# EasyEDA Pro project 单向户外电源_明月班.epro, board PCB11
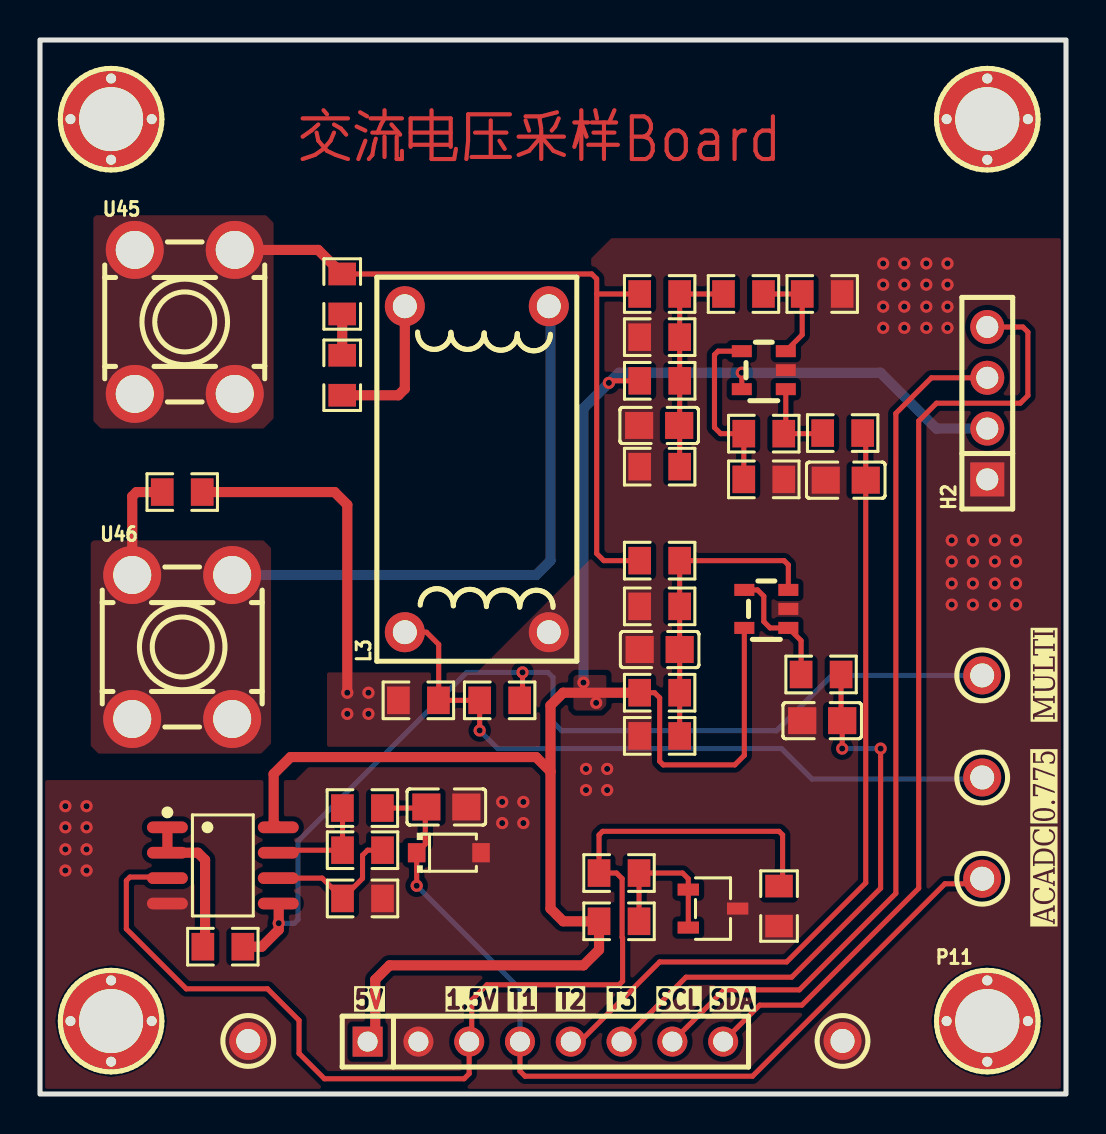
[diagram p18: board, top side]
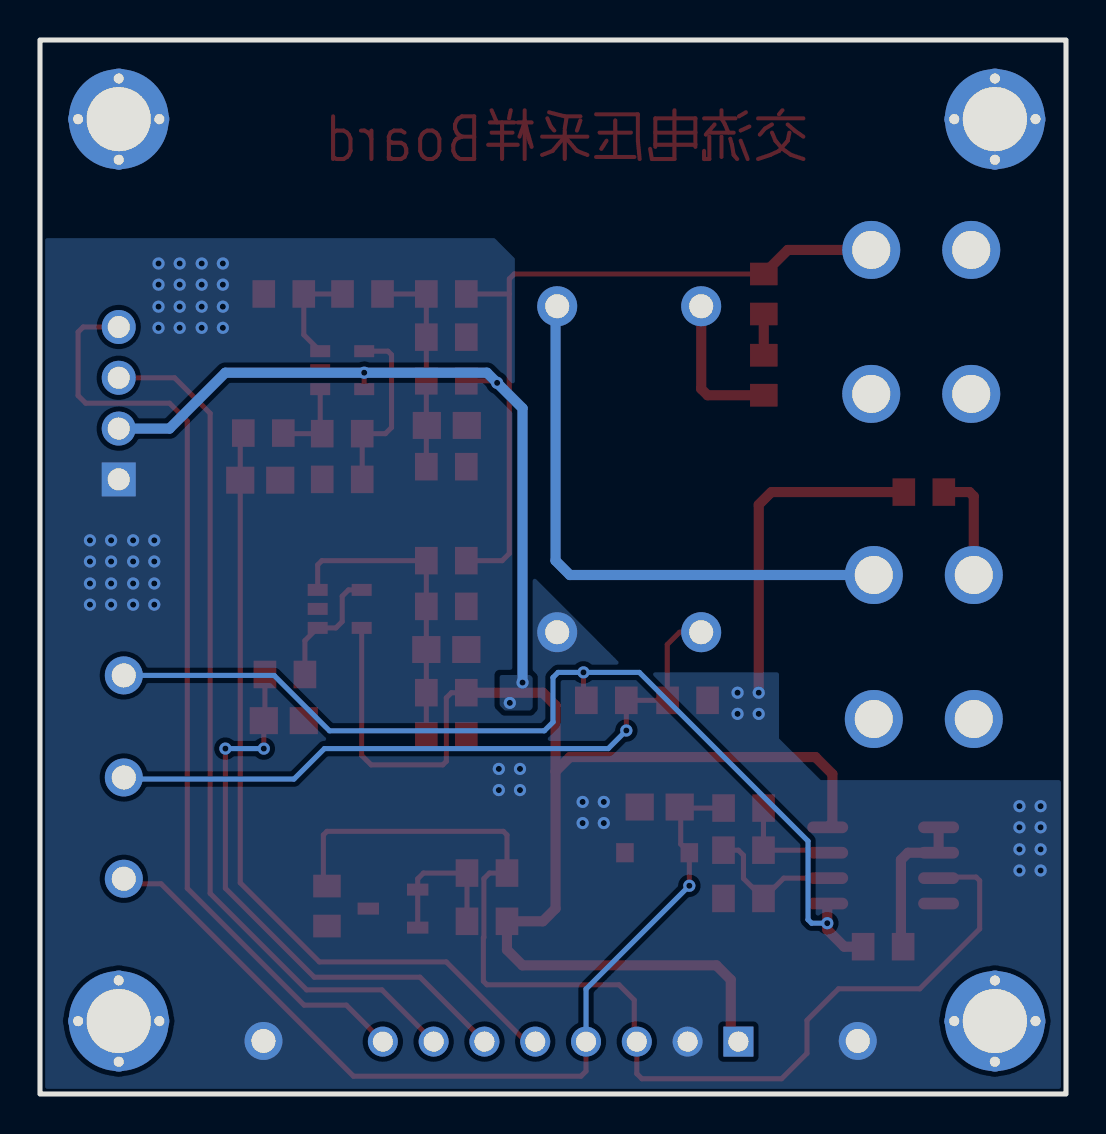
[diagram p19: board, bottom side, seen from below]

Outline 51.31 x 52.71 mm; copper layers: Top Layer, Bottom Layer. Coordinates in mm from the lower left corner of the outline.
Outline path: rectangle 0,52.71 51.31,0
Stack: Top Layer 0.035mm / Dielectric1 1.51mm FR4 er 4.5 / Bottom Layer 0.035mm

## Design rules (mm)
template: 自定义配置
spacing copperThickness1oz (default): track to track 0.102, other pairs 0.152 to 0.3
spacing copperThickness2oz: track to track 0.203, other pairs 0.152 to 0.3
track width copperThickness1oz (default): min 0.127, default 0.254, max 2.54
track width copperThickness2oz: min 0.203, default 0.254, max 2.54
differential pair differentialPair (default): width min 0.127, default 0.254, max 2.54; gap min 0.152, default 0.152
via viaSize (default): diameter min 0.5, default 0.61, max 10; hole min 0.3, default 0.305, max 6.3

## Placement (name value [footprint] x y rotation side)
C1  1nF  [C0805]  30.96 33.43 0 top
C2  1nF  [C0805]  40.29 30.69 0 top
C3  1nF  [C0805]  30.99 22.23 0 top
C4  1nF  [C0805]  39.12 18.67 0 top
C5  47nF  [C0805]  20.32 14.35 180 top
D1  LBAT46T1G  [SOD-123_L2.7-W1.6-LS3.7-RD-4]  20.45 12.07 0 top
H2  -  [HDR-TH_4P-P2.54-V-F]  47.37 34.54 90 top
H3  -  [HDR-TH_8P-P2.54-V-M]  25.27 2.62 0 top
L3  ZMPT107-1  [XFMR-TH_ZMPT107-1]  21.84 31.24 90 top
P8  -  [固定孔]  3.56 3.65 0 top
P9  -  [固定孔]  3.56 48.75 0 top
P10  -  [固定孔]  47.37 48.75 0 top
P11  -  [固定孔]  47.37 3.65 0 top
R1  390K  [R0805]  30.99 40.01 0 top
R2  2K  [R0805]  30.99 37.85 0 top
R3  10K  [R0805]  30.99 31.37 0 top
R4  10K  [R0805]  35.18 40.01 180 top
R5  10K  [R0805]  36.2 30.73 0 top
R6  10K  [R0805]  36.2 33.02 180 top
R7  470  [R0805]  40.14 33.05 180 top
R8  4.7K  [R0805]  30.99 35.66 180 top
R9  10K  [R0805]  39.12 40.01 180 top
R10  390K  [R0805]  30.99 26.67 0 top
R11  2K  [R0805]  30.99 24.38 0 top
R12  10K  [R0805]  30.99 17.91 0 top
R16  470  [R0805]  39.06 20.98 180 top
R17  4.7K  [R0805]  30.99 20.07 180 top
R18  100K  [R0805]  15.11 35.94 270 top
R19  100K  [R0805]  15.11 40.01 270 top
R20  500R  [R0805]  18.92 19.69 0 top
R21  1K  [R0805]  28.96 8.64 0 top
R22  1K  [R0805]  28.96 11.05 0 top
R23  1.5K  [R0805]  36.96 9.4 90 top
R24  1K  [R0805]  9.14 7.37 0 top
R25  1K  [R0805]  22.99 19.69 0 top
R26  1K  [R0805]  16.13 9.78 180 top
R27  1K  [R0805]  16.13 12.19 180 top
R28  100R  [R0805]  16.12 14.3 0 top
R29  0R  [R0805]  7.11 30.1 0 top
U5  TLV333IDBVR  [SOT-23-5_L2.9-W1.6-P0.95-LS2.8-BL]  36.2 36.2 90 top
U6  TLV333IDBVR  [SOT-23-5_L2.9-W1.6-P0.95-LS2.8-BL]  36.32 24.26 90 top
U45  T44001  [CONN-TH_T44001]  7.24 38.61 0 top
U46  T44001  [CONN-TH_T44001]  7.11 22.35 0 top
U52  TL431-0.5%  [SOT-23-3_L2.9-W1.6-P1.90-LS2.8-BR]  33.66 9.27 180 top
U53  OPA2188AIDR  [SOIC-8_L4.9-W3.9-P1.27-LS6.0-BL]  9.14 11.43 270 top
U68  RH-5000  [TEST-TH_BD2.54-P1.4_RED]  47.12 15.83 0 top
U69  RH-5000  [TEST-TH_BD2.54-P1.4_RED]  40.13 2.65 0 top
U70  RH-5000  [TEST-TH_BD2.54-P1.4_RED]  47.12 10.76 0 top
U71  RH-5000  [TEST-TH_BD2.54-P1.4_RED]  47.12 20.93 0 top
U72  RH-5000  [TEST-TH_BD2.54-P1.4_RED]  10.41 2.65 0 top

## Footprints (pads in the part's own frame, mm; a bottom-side part is the same pattern mirrored in y, then rotated)
C0805
  rect 1.41x1.35 smd: 1(-1,0) 2(1,0)
CONN-TH_T44001
  round 2.9 hole 1.9: 1(-2.5,3.6) 2(-2.5,-3.6) 3(2.5,-3.6) 4(2.5,3.6)
HDR-TH_4P-P2.54-V-F
  rect 1.7x1.7 hole 1.1: 1(-3.81,0)
  round 1.7 hole 1.1: 2(-1.27,0) 3(1.27,0) 4(3.81,0)
HDR-TH_8P-P2.54-V-M
  rect 1.5x1.5 hole 1: 1(-8.89,0)
  round 1.5 hole 1: 2(-6.35,0) 3(-3.81,0) 4(-1.27,0) 5(1.27,0) 6(3.81,0) 7(6.35,0) 8(8.89,0)
R0805
  rect 1.133x1.377 smd: 1(-1,0) 2(1,0)
SOD-123_L2.7-W1.6-LS3.7-RD-4
  rect 0.88x0.96 smd: 1(-1.61,0) 2(1.61,0)
SOIC-8_L4.9-W3.9-P1.27-LS6.0-BL
  oval 0.588x2.045 smd: 1(-1.905,-2.772) 2(-0.635,-2.772) 3(0.635,-2.772) 4(1.905,-2.772) 5(1.905,2.772) 6(0.635,2.772) 7(-0.635,2.772) 8(-1.905,2.772)
SOT-23-3_L2.9-W1.6-P1.90-LS2.8-BR
  rect 1.07x0.6 smd: 1(1.235,-0.95) 2(1.235,0.95) 3(-1.235,0)
SOT-23-5_L2.9-W1.6-P0.95-LS2.8-BL
  rect 0.6x1 smd: 1(-0.95,-1.1) 2(0,-1.1) 3(0.95,-1.1) 4(0.95,1.1) 5(-0.95,1.1)
TEST-TH_BD2.54-P1.4_RED
  round 1.9 hole 1.2: 1(0,0)
XFMR-TH_ZMPT107-1
  round 2 hole 1.2: 1(-8.15,3.6) 2(-8.15,-3.6) 3(8.15,3.6) 4(8.15,-3.6)
固定孔
  round 1 hole 0.5x0.505: 1(-2.032,0) 3(2.032,0)
  round 1 hole 0.505x0.5: 2(0,-2.032) 4(0,2.032)
  round 5 hole 3.205x3.2: 5(0,0)

## Nets
As in the schematic.

Pads without a net: P8 1 2 3 4 5; P9 1 2 3 4 5; P10 1 2 3 4 5; P11 1 2 3 4 5

## Via types
v1: diameter 0.61, hole 0.305, Top Layer to Bottom Layer, 62 vias

## Routing (per net, layer and track width the routed paths; a pad name or vN(x,y) marks a point on that pad's centre or on a via; arc(x,y) is an arc through that point)
5V: length 104.7
  Top Layer w0.254: R17.2 30.73,20.07 30.99,19.81 30.99,16.64 31.17,16.46 34.75,16.46 35.22,16.93 35.22,23.31 ; R8.2 28.55,35.66 v1(28.45,35.56) ; U5.5 v1(35.1,36.07)
  Top Layer w0.508: 25.53,16.13 25.53,19.43 26.16,20.07 R17.2 ; 25.53,16.13 24.81,16.85 12.53,16.85 11.68,16 11.68,13.57 U53.8 ; 25.53,16.13 25.53,9.27 26.16,8.64 R21.1 27.96,7.21 27.18,6.43 17.48,6.43 16.76,5.72 16.76,3 H3.1
  Bottom Layer w0.508: H2.2 44.83,33.27 42.04,36.07 v1(35.1,36.07) 28.96,36.07 v1(28.45,35.56) 27.18,34.29 v1(27.18,20.57)
  vias: v1(27.81,19.56)
GND: length 16.9
  Top Layer w0.508: R29.2 14.73,30.1 15.37,29.46 v1(15.37,20.07)
  vias: v1(1.27,14.39) v1(1.27,13.34) v1(1.27,12.23) v1(1.27,11.18) v1(2.33,14.39) v1(2.33,13.34) v1(2.33,12.23) v1(2.33,11.18) v1(15.37,19.01) v1(16.42,20.07) v1(16.42,19.01) v1(23.11,14.61) v1(23.11,13.55) v1(24.17,14.61) v1(24.17,13.55) v1(27.3,16.26) v1(27.3,15.2) v1(28.36,16.26) v1(28.36,15.2) v1(42.16,41.53) v1(42.16,40.47) v1(42.16,39.37) v1(42.16,38.31) v1(43.22,41.53) v1(43.22,40.47) v1(43.22,39.37) v1(43.22,38.31) v1(44.32,41.53) v1(44.32,40.47) v1(44.32,39.37) v1(44.32,38.31) v1(45.38,41.53) v1(45.38,40.47) v1(45.38,39.37) v1(45.38,38.31) v1(45.59,27.69) v1(45.59,26.63) v1(45.59,25.53) v1(45.59,24.47) v1(46.65,27.69) v1(46.65,26.63) v1(46.65,25.53) v1(46.65,24.47) v1(47.75,27.69) v1(47.75,26.63) v1(47.75,25.53) v1(47.75,24.47) v1(48.81,27.69) v1(48.81,26.63) v1(48.81,25.53) v1(48.81,24.47)
0.775: length 34.5
  Top Layer w0.254: v1(21.99,18.18) R25.1 R20.2 19.94,19.7 19.94,22.48 19.33,23.09 L3.1
  Bottom Layer w0.254: U68.1 47.04,15.75 38.61,15.75 37.08,17.27 22.89,17.27 v1(21.99,18.18)
AC-T: length 40.6
  Top Layer w0.254: R7.1 41.29,32.9 C2.2 41.29,10.56 37.34,6.6 30.99,6.6 27,2.62 H3.5
AC-T1: length 28.8
  Top Layer w0.254: R16.1 40.06,18.73 C4.2 v1(40.12,17.27) ; v1(42.04,17.27) 42.04,10.29 37.59,5.84 32.3,5.84 H3.6
  Bottom Layer w0.254: v1(40.12,17.27) v1(42.04,17.27)
I2C1-SCL: length 43.6
  Top Layer w0.254: H2.3 44.58,35.81 42.8,34.04 42.8,10.03 37.97,5.21 34.21,5.21 H3.7
I2C1-SDA: length 47.6
  Top Layer w0.254: H3.8 35.99,4.45 38.1,4.45 43.94,10.29 43.94,33.66 44.83,34.54 49.02,34.54 49.4,34.93 49.4,38.1 49.15,38.35 H2.4
MULTI: length 51.3
  Top Layer w0.254: v1(24.13,21.08) 24.13,19.83 R25.2
  Top Layer w0.508: U53.5 11.94,9.5 v1(11.94,8.54) 11.94,8.21 11.09,7.37 R24.2
  Bottom Layer w0.254: U71.1 39.6,20.93 36.83,18.16 26.09,18.16 25.65,18.59 25.65,20.83 25.4,21.08 v1(24.13,21.08) 21.34,21.08 12.9,12.65 12.9,8.72 12.72,8.54 v1(11.94,8.54)
VAC+: length 36.9
  Top Layer w0.254: 27.84,40.77 27.84,40.01 ; 27.84,40.01 27.84,27.02 28.19,26.67 R10.1 ; 27.84,40.01 R1.1 ; 27.83,40.77 27.59,41.01 R19.1
  Top Layer w0.508: R19.1 13.91,42.21 U45.4
VAC-: length 34.5
  Top Layer w0.508: U46.1 4.61,29.89 4.83,30.1 R29.1
  Bottom Layer w0.508: U46.4 24.81,25.95 25.53,26.67 25.53,39.31 L3.4
VAC-ADC: length 45
  Top Layer w0.254: U70.1 46.86,10.51 45.25,10.51 35.63,0.89 24.26,0.89 24,1.14 H3.4 ; R28.2 19.27,14.3 ; 19.27,14.3 19.27,12.5 D1.1 v1(18.84,10.41) ; 19.27,14.3 C5.2
  Bottom Layer w0.254: v1(18.84,10.41) 24,5.25 H3.4
VREF-1.5: length 57.8
  Top Layer w0.254: U53.3 6.32,10.85 4.5,10.85 4.32,10.67 4.32,8.26 7.31,5.26 11.38,5.26 12.95,3.68 12.95,2.03 14.22,0.76 21.21,0.76 21.46,1.02 H3.3 21.59,2.75 21.59,4.7 22.35,5.46 28.96,5.46 29.14,5.64 29.14,7.81 29.11,7.83 29.11,10.77 28.83,11.05 R22.1 27.96,12.95 28.14,13.13 36.96,13.13 37.14,12.95 37.14,10.58 R23.2
$1N374: length 10.8
  Top Layer w0.254: R3.2 R2.2 R1.2 R4.2
$1N496: length 5.1
  Top Layer w0.254: R4.1 R9.2 38.12,37.97 U5.3
$1N538: length 4.2
  Top Layer w0.254: U5.1 37.3,33.12 R6.1 39.11,33.02 R7.2
$1N1143: length 15.5
  Top Layer w0.254: U6.3 37.42,26.46 37.21,26.67 R10.2 R11.2 C3.2 R17.1 R12.2
$1N1250: length 6.3
  Top Layer w0.254: R16.2 38.06,22.67 U6.1 36.51,23.31 36.2,23.62 36.2,24.89 35.88,25.21 35.22,25.21
$1N1290: length 9
  Top Layer w0.254: U5.4 33.91,37.15 33.73,36.97 33.73,33.33 34.04,33.02 R6.2 R5.1
$1N1633: length 7.4
  Top Layer w0.508: L3.3 18.24,35.26 17.92,34.94 R18.2
$1N1692: length 2.1
  Top Layer w0.508: R19.2 R18.1
$1N1877: length 7.4
  Top Layer w0.254: R21.2 R22.2 32.13,11.05 32.42,10.76 U52.1 U52.2
$1N2322: length 7.7
  Top Layer w0.508: R24.1 8.26,7.48 8.26,11.71 7.9,12.07 U53.2 U53.1
$1N2536: length 7.3
  Top Layer w0.254: R27.1 16.38,12.19 16.13,11.94 16.13,10.78 R26.2 14.11,10.8 U53.6
$1N2575: length 5.4
  Top Layer w0.254: U53.7 12.04,12.19 R27.2 15.13,14.29 R28.1

## Copper pours and planes (outline as drawn; the poured copper is in the pictures)
5V on Top Layer: 26.8,20.96 28.32,20.96 28.32,19.43 28.07,19.18 26.8,19.18 26.67,19.3 26.67,20.83
5V on Bottom Layer: 26.8,20.96 28.32,20.96 28.32,19.43 28.07,19.18 26.8,19.18 26.67,19.3 26.67,20.83
GND on Top Layer: 0,15.7 12.78,15.7 14.35,17.27 14.35,21.08 21.84,21.08 27.56,26.8 27.56,41.78 28.58,42.8 51.31,42.8 51.31,0 0.13,0 0,0.13
GND on Bottom Layer: 0,15.7 12.27,15.7 14.35,17.78 14.35,21.08 21.84,21.08 27.56,26.8 27.56,41.78 28.58,42.8 51.31,42.8 51.31,0 0.13,0 0,0.13
VAC+ on Top Layer: 2.79,43.94 11.3,43.94 11.68,43.56 11.68,33.78 11.18,33.27 3.05,33.27 2.67,33.66 2.67,43.82
VAC- on Top Layer: 2.67,27.69 11.18,27.69 11.56,27.31 11.56,17.53 11.05,17.02 2.92,17.02 2.54,17.4 2.54,27.56

## Text on the board
Top Layer: 交流电压采样Board
Top Solder Mask Layer: 交流电压采样Board
Top Silkscreen Layer: 5V | 1.5V | T1 | T2 | T3 | SCL | SDA | MULTI | 0.775 | ACADC
